# EAGLE design relay (EAGLE 6.5.0)
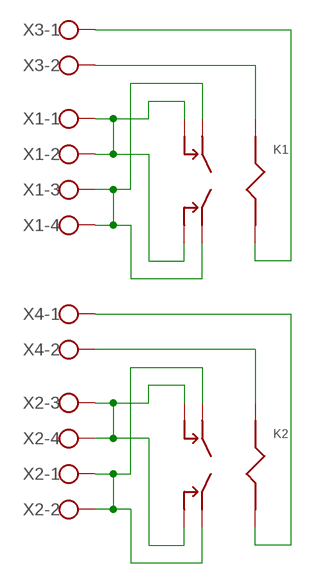
[diagram p0: schematic, sheet 1]

## Parts
K1  T92S7D12  [T92-PCPIN]
K2  T92S7D12  [T92-PCPIN]
X1  W237-4  [W237-4]
X2  W237-4  [W237-4]
X3  W237-102  [W237-102]
X4  W237-102  [W237-102]

## Nets
N$1: K1.2A K1.2B K1.6A K1.6B X1.1 X1.2
N$3: K1.4A K1.4B K1.8A K1.8B X1.3 X1.4
N$5: K1.0A K1.0B X3.2
N$6: K1.1A K1.1B X3.1
N$7: K2.2A K2.2B K2.6A K2.6B X2.3 X2.4
N$9: K2.4A K2.4B K2.8A K2.8B X2.1 X2.2
N$11: K2.0A K2.0B X4.2
N$12: K2.1A K2.1B X4.1

## Library data of the parts
K1 K2 = relay:T92S7D12
X1 X2 = con-wago-500:W237-4: WAGO SCREW CLAMP; OC_FARNELL: unknown; OC_NEWARK: unknown
X3 X4 = con-wago-500:W237-102: WAGO SCREW CLAMP; MPN: 237-102; OC_FARNELL: unknown; OC_NEWARK: 70K9898

## Board
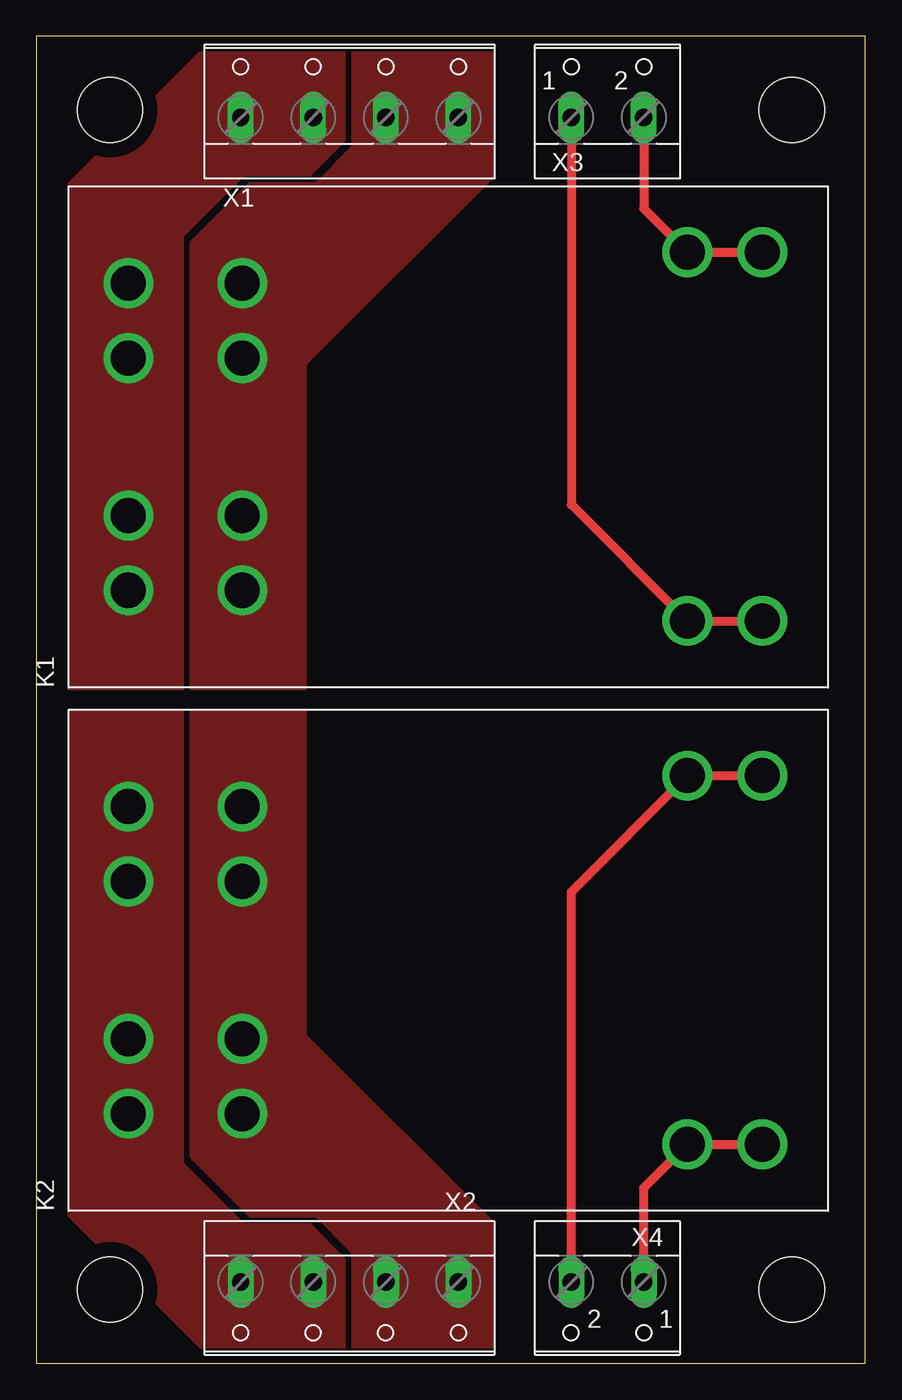
[diagram p1: board, top side]
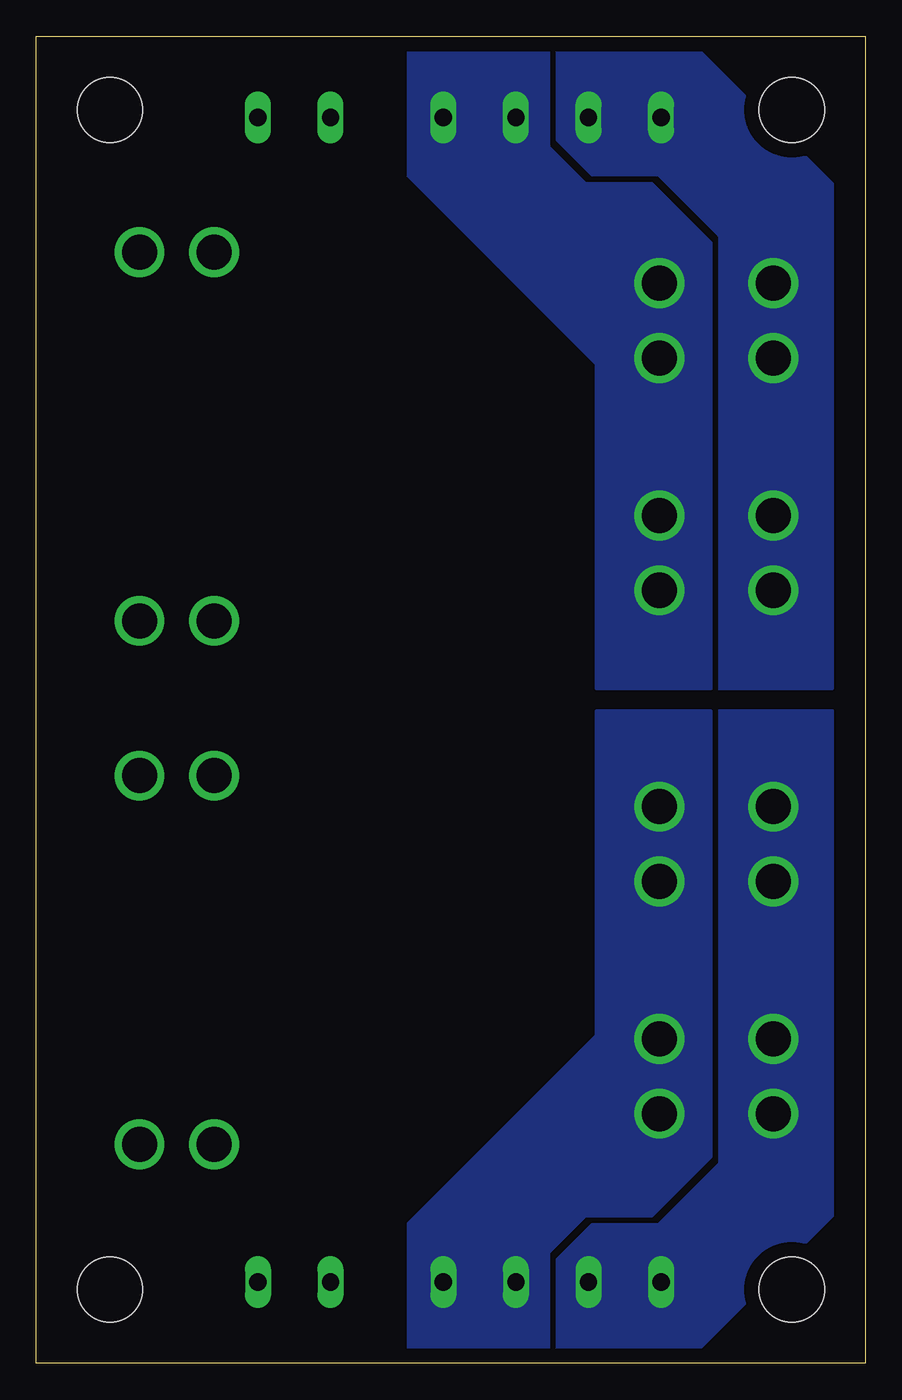
[diagram p2: board, bottom side, seen from below]

Size 57.15 x 91.44 mm. Coordinates in mm from the lower left corner, seen from the top.
Outline: 0,0 57.15,0 57.15,91.44 0,91.44 0,0
Copper layers (1*16): Top 0.035mm / dielectric 1.5mm / Bottom 0.035mm
Design rules "default": minimum track width 10mil, minimum drill 24mil, track to track 8mil, track to pad 8mil, pad to pad 8mil, via to via 8mil, smd to smd 8mil, copper to edge 40mil, drill to drill 8mil, minimum pad ring 10mil, minimum via ring 8mil, stop-mask expansion 4mil, vias tented up to drill 0mil, thermal gap 10mil
Holes 4.5 mm at 5.08,86.36 52.07,86.36 52.07,5.08 5.08,5.08

### Footprints (pad centres in the part's own frame; a part is rotated, then mirrored left to right if it is on the bottom)
T92-PCPIN = drill 2.413: 0A 38.532,2.134; 0B 43.688,2.134; 1A 38.532,-23.266; 1B 43.688,-23.266; 2A 0,0; 2B 0,-5.156; 4A 7.849,0; 4B 7.849,-5.156; 6A 0,-16.002; 6B 0,-21.158; 8A 7.849,-16.002; 8B 7.849,-21.158
W237-4 = drill 1.194 long: 1 -7.5,-1.27; 2 -2.5,-1.27; 3 2.5,-1.27; 4 7.5,-1.27
W237-102 = drill 1.194 long: 1 -2.5,-1.27; 2 2.5,-1.27

### Placement (x,y rotation side)
K1  6.35,74.42 0 top
K2  6.35,38.35 0 top
X1  21.59,87.12 0 top
X2  21.59,4.32 180 top
X3  39.37,87.12 0 top
X4  39.37,4.32 180 top

### Tracks (layer width: path | path; a pad name or v marks a point on that pad's centre or on a via)
N$1
  pour Top (isolate 0.406, rank 2, no thermals): 10.16,46.48 2.29,46.48 2.29,81.28 11.68,90.68 21.34,90.68 21.34,84.07 19.05,81.79 14.48,81.79 10.16,77.47
  pour Bottom (isolate 0.406, rank 2, no thermals): 10.16,46.48 2.29,46.48 2.29,81.28 11.68,90.68 21.34,90.68 21.34,84.07 19.05,81.79 14.48,81.79 10.16,77.47
N$3
  pour Top (isolate 0.406, no thermals): 21.84,90.68 31.5,90.68 31.5,81.79 18.54,68.83 18.54,46.48 10.67,46.48 10.67,77.22 14.73,81.28 19.3,81.28 21.84,83.82
  pour Bottom (isolate 0.406, no thermals): 21.84,90.68 31.5,90.68 31.5,81.79 18.54,68.83 18.54,46.48 10.67,46.48 10.67,77.22 14.73,81.28 19.3,81.28 21.84,83.82
N$5
  Top 0.61: X3.2 41.87,79.57 K1.0A K1.0B
N$6
  Top 0.61: X3.1 36.87,59.17 K1.1A K1.1B
N$7
  pour Top (isolate 0.406, rank 2, no thermals): 10.16,44.96 2.29,44.96 2.29,10.16 11.68,0.76 21.34,0.76 21.34,7.37 19.05,9.65 14.48,9.65 10.16,13.97
  pour Bottom (isolate 0.406, rank 2, no thermals): 10.16,44.96 2.29,44.96 2.29,10.16 11.68,0.76 21.34,0.76 21.34,7.37 19.05,9.65 14.48,9.65 10.16,13.97
N$9
  pour Top (isolate 0.406, no thermals): 21.84,0.76 31.5,0.76 31.5,9.65 18.54,22.61 18.54,44.96 10.67,44.96 10.67,14.22 14.73,10.16 19.3,10.16 21.84,7.62
  pour Bottom (isolate 0.406, no thermals): 21.84,0.76 31.5,0.76 31.5,9.65 18.54,22.61 18.54,44.96 10.67,44.96 10.67,14.22 14.73,10.16 19.3,10.16 21.84,7.62
N$11
  Top 0.61: X4.2 36.87,32.48 K2.0A K2.0B
N$12
  Top 0.61: X4.1 41.87,12.08 K2.1A K2.1B